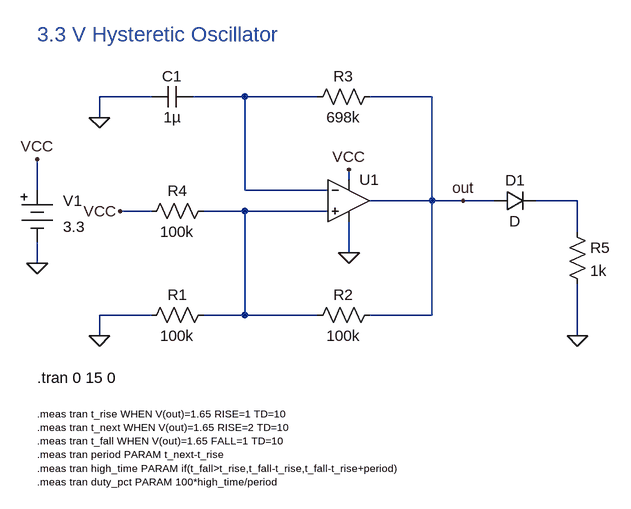
[diagram p0: schematic MP1.asc]
MP1.asc, the LTspice schematic file:
Version 4.1
SHEET 1 1088 768
WIRE 240 96 160 96
WIRE 384 96 304 96
WIRE 496 96 384 96
WIRE 672 96 576 96
WIRE 160 128 160 96
WIRE 544 224 544 208
WIRE 64 240 64 192
WIRE 384 240 384 96
WIRE 512 240 384 240
WIRE 672 256 672 96
WIRE 672 256 576 256
WIRE 720 256 672 256
WIRE 768 256 720 256
WIRE 896 256 832 256
WIRE 240 272 192 272
WIRE 384 272 320 272
WIRE 512 272 384 272
WIRE 896 304 896 256
WIRE 544 336 544 288
WIRE 64 352 64 320
WIRE 240 432 160 432
WIRE 384 432 384 272
WIRE 384 432 320 432
WIRE 496 432 384 432
WIRE 672 432 672 256
WIRE 672 432 576 432
WIRE 160 464 160 432
WIRE 896 464 896 384
FLAG 160 128 0
FLAG 544 208 VCC
FLAG 64 192 VCC
FLAG 192 272 VCC
FLAG 544 336 0
FLAG 64 352 0
FLAG 160 464 0
FLAG 896 464 0
FLAG 720 256 out
SYMBOL res 336 416 R90
WINDOW 0 0 56 VBottom 2
WINDOW 3 32 56 VTop 2
SYMATTR InstName R1
SYMATTR Value 100k
SYMBOL res 592 416 R90
WINDOW 0 0 56 VBottom 2
WINDOW 3 32 56 VTop 2
SYMATTR InstName R2
SYMATTR Value 100k
SYMBOL res 592 80 R90
WINDOW 0 0 56 VBottom 2
WINDOW 3 32 56 VTop 2
SYMATTR InstName R3
SYMATTR Value 698k
SYMBOL cap 304 80 R90
WINDOW 0 0 32 VBottom 2
WINDOW 3 32 32 VTop 2
SYMATTR InstName C1
SYMATTR Value 1µ
SYMATTR SpiceLine V=16 Irms=0 Rser=11 Lser=0
SYMBOL Misc\\battery 64 224 R0
WINDOW 0 40 32 Left 2
WINDOW 3 40 72 Left 2
WINDOW 123 0 0 Left 0
WINDOW 39 0 0 Left 0
SYMATTR InstName V1
SYMATTR Value 3.3
SYMBOL res 336 256 R90
WINDOW 0 0 56 VBottom 2
WINDOW 3 32 56 VTop 2
SYMATTR InstName R4
SYMATTR Value 100k
SYMBOL OpAmps\\UniversalOpAmp2 544 256 R0
SYMATTR InstName U1
SYMBOL diode 768 272 R270
WINDOW 0 32 32 VTop 2
WINDOW 3 0 32 VBottom 2
SYMATTR InstName D1
SYMBOL res 880 288 R0
SYMATTR InstName R5
SYMATTR Value 1k
TEXT 64 0 Left 3 ;3.3 V Hysteretic Oscillator
TEXT 64 528 Left 2 !.tran 0 15 0
TEXT 64 584 Left 1 !.meas tran t_rise WHEN V(out)=1.65 RISE=1 TD=10\n.meas tran t_next WHEN V(out)=1.65 RISE=2 TD=10\n.meas tran t_fall WHEN V(out)=1.65 FALL=1 TD=10\n.meas tran period PARAM t_next-t_rise\n.meas tran high_time PARAM if(t_fall>t_rise,t_fall-t_rise,t_fall-t_rise+period)\n.meas tran duty_pct PARAM 100*high_time/period

The netlist it stands for:
* MP1.asc
R1 N003 0 100k
R2 out N003 100k
R3 out N001 698k
C1 N001 0 1µ V=16 Irms=0 Rser=11 Lser=0
V1 VCC 0 3.3
R4 N003 VCC 100k
X§U1 N003 N001 VCC 0 out level2 Avol=1Meg GBW=10Meg Slew=10Meg Ilimit=25m Rail=0 Vos=0 En=0 Enk=0 In=0 Ink=0 Rin=500Meg  ; pins In+ In- V+ V- OUT
D1 out N002 D
R5 N002 0 1k
.model D D
.lib standard.dio
* 3.3 V Hysteretic Oscillator
.tran 0 15 0
.meas tran t_rise WHEN V(out)=1.65 RISE=1 TD=10
.meas tran t_next WHEN V(out)=1.65 RISE=2 TD=10
.meas tran t_fall WHEN V(out)=1.65 FALL=1 TD=10
.meas tran period PARAM t_next-t_rise
.meas tran high_time PARAM if(t_fall>t_rise,t_fall-t_rise,t_fall-t_rise+period)
.meas tran duty_pct PARAM 100*high_time/period
.lib UniversalOpAmp2.lib
.backanno
.end